# Altium project eRTM15_Baikal.PrjPCB (part 1 of 4)
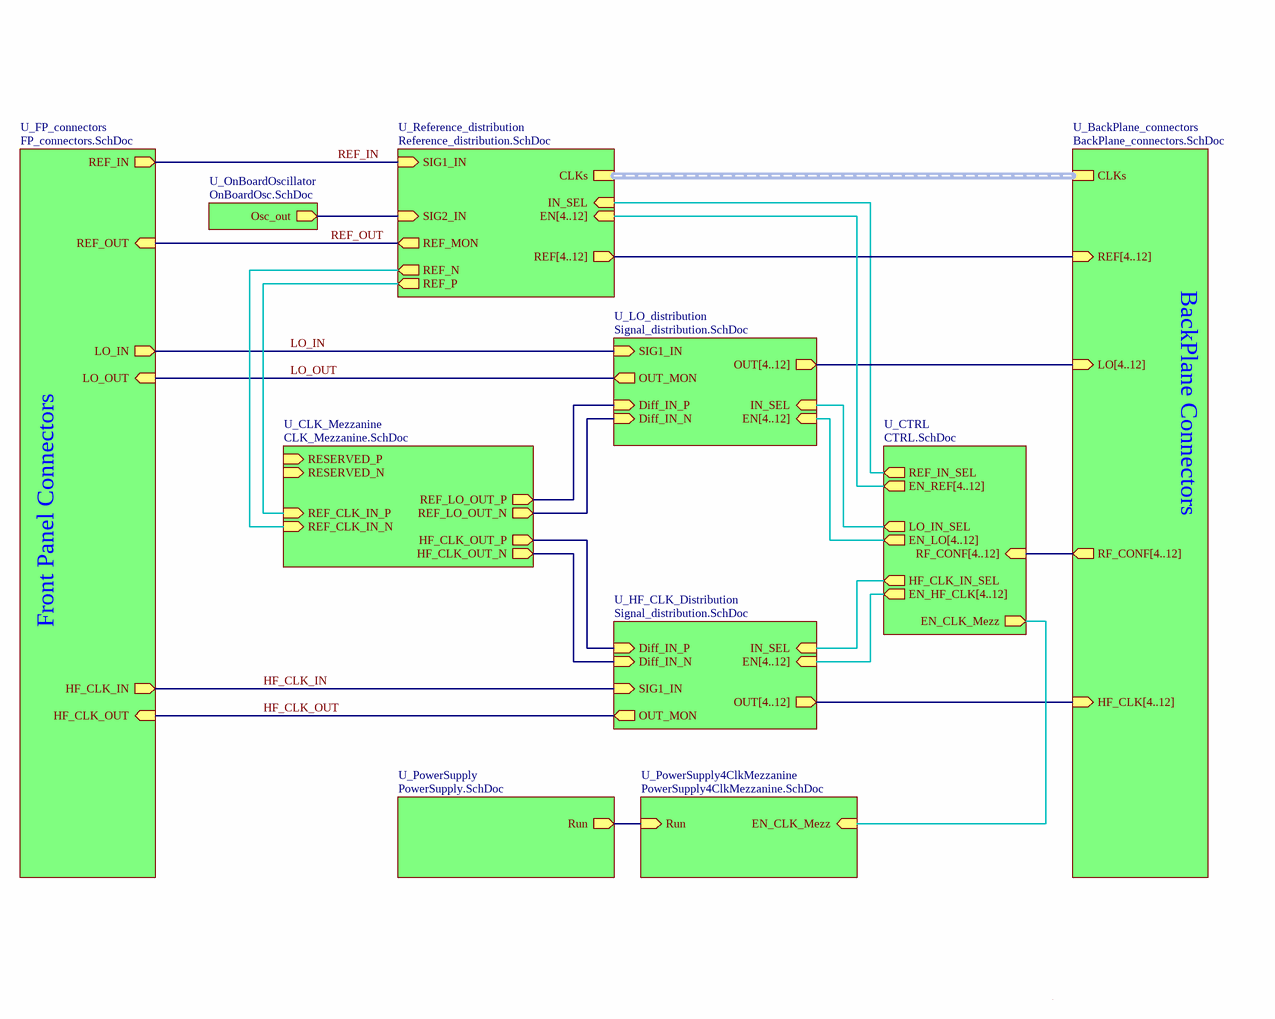
[diagram p0: Baikal_top.SchDoc]
ProjectName: eRTM15 Baikal
12 sheets, 749 parts. Net scope: hierarchical (ports join the sheet entries above them; power ports are global).
Board file: eRTM15_Baikal.PcbDoc
Sheets:
  Baikal_top.SchDoc
    U_FP_connectors = FP_connectors.SchDoc
    U_PowerSupply = PowerSupply.SchDoc
    U_BackPlane_connectors = BackPlane_connectors.SchDoc
    U_CLK_Mezzanine = CLK_Mezzanine.SchDoc
    U_Reference_distribution = Reference_distribution.SchDoc
      U_Diff2SE = Diff2SE.SchDoc
      U_Diff2SE = Diff2SE.SchDoc
      U_Diff2SE = Diff2SE.SchDoc
      U_Diff2SE = Diff2SE.SchDoc
      U_Diff2SE = Diff2SE.SchDoc
      U_Diff2SE = Diff2SE.SchDoc
      U_Diff2SE = Diff2SE.SchDoc
      U_Diff2SE = Diff2SE.SchDoc
      U_Diff2SE = Diff2SE.SchDoc
      U_Diff2SE = Diff2SE.SchDoc
      U_Diff2SE = Diff2SE.SchDoc
      U_Diff2SE = Diff2SE.SchDoc
      U_LvpeclTermWithCtrl = LvpeclTermWithCtrl.SchDoc
      U_LvpeclTermWithCtrl = LvpeclTermWithCtrl.SchDoc
      U_LvpeclTermWithCtrl = LvpeclTermWithCtrl.SchDoc
      U_LvpeclTermWithCtrl = LvpeclTermWithCtrl.SchDoc
      U_LvpeclTermWithCtrl = LvpeclTermWithCtrl.SchDoc
      U_LvpeclTermWithCtrl = LvpeclTermWithCtrl.SchDoc
      U_LvpeclTermWithCtrl = LvpeclTermWithCtrl.SchDoc
      U_LvpeclTermWithCtrl = LvpeclTermWithCtrl.SchDoc
      U_LvpeclTermWithCtrl = LvpeclTermWithCtrl.SchDoc
      U_LvpeclTermWithCtrl = LvpeclTermWithCtrl.SchDoc
      U_Diff2SE = Diff2SE.SchDoc
      U_LvpeclTermWithCtrl = LvpeclTermWithCtrl.SchDoc
      U_LvpeclTermWithCtrl = LvpeclTermWithCtrl.SchDoc
      U_LvpeclTermWithCtrl = LvpeclTermWithCtrl.SchDoc
      U_LvpeclTermWithCtrl = LvpeclTermWithCtrl.SchDoc
      U_LvpeclTermWithCtrl = LvpeclTermWithCtrl.SchDoc
      U_LvpeclTermWithCtrl = LvpeclTermWithCtrl.SchDoc
      U_LvpeclTermWithCtrl = LvpeclTermWithCtrl.SchDoc
      U_LvpeclTermWithCtrl = LvpeclTermWithCtrl.SchDoc
      U_LvpeclTermWithCtrl = LvpeclTermWithCtrl.SchDoc
      U_LvpeclTermWithCtrl = LvpeclTermWithCtrl.SchDoc
      U_LvpeclTermWithCtrl = LvpeclTermWithCtrl.SchDoc
      U_LvpeclTermWithCtrl = LvpeclTermWithCtrl.SchDoc
      U_LvpeclTermWithCtrl = LvpeclTermWithCtrl.SchDoc
    U_OnBoardOscillator = OnBoardOsc.SchDoc
    U_LO_distribution = Signal_distribution.SchDoc
      U_Diff2SE = Diff2SE.SchDoc
      U_Diff2SE = Diff2SE.SchDoc
      U_Diff2SE = Diff2SE.SchDoc
      U_Diff2SE = Diff2SE.SchDoc
      U_Diff2SE = Diff2SE.SchDoc
      U_Diff2SE = Diff2SE.SchDoc
      U_Diff2SE = Diff2SE.SchDoc
      U_Diff2SE = Diff2SE.SchDoc
      U_Diff2SE = Diff2SE.SchDoc
      U_Diff2SE = Diff2SE.SchDoc
      U_LvpeclTermWithCtrl = LvpeclTermWithCtrl.SchDoc
      U_LvpeclTermWithCtrl = LvpeclTermWithCtrl.SchDoc
      U_LvpeclTermWithCtrl = LvpeclTermWithCtrl.SchDoc
      U_LvpeclTermWithCtrl = LvpeclTermWithCtrl.SchDoc
      U_LvpeclTermWithCtrl = LvpeclTermWithCtrl.SchDoc
      U_LvpeclTermWithCtrl = LvpeclTermWithCtrl.SchDoc
      U_LvpeclTermWithCtrl = LvpeclTermWithCtrl.SchDoc
      U_LvpeclTermWithCtrl = LvpeclTermWithCtrl.SchDoc
      U_LvpeclTermWithCtrl = LvpeclTermWithCtrl.SchDoc
      U_Diff2SE = Diff2SE.SchDoc
      U_LvpeclTermWithCtrl = LvpeclTermWithCtrl.SchDoc
    U_HF_CLK_Distribution = Signal_distribution.SchDoc
      U_Diff2SE = Diff2SE.SchDoc
      U_Diff2SE = Diff2SE.SchDoc
      U_Diff2SE = Diff2SE.SchDoc
      U_Diff2SE = Diff2SE.SchDoc
      U_Diff2SE = Diff2SE.SchDoc
      U_Diff2SE = Diff2SE.SchDoc
      U_Diff2SE = Diff2SE.SchDoc
      U_Diff2SE = Diff2SE.SchDoc
      U_Diff2SE = Diff2SE.SchDoc
      U_Diff2SE = Diff2SE.SchDoc
      U_LvpeclTermWithCtrl = LvpeclTermWithCtrl.SchDoc
      U_LvpeclTermWithCtrl = LvpeclTermWithCtrl.SchDoc
      U_LvpeclTermWithCtrl = LvpeclTermWithCtrl.SchDoc
      U_LvpeclTermWithCtrl = LvpeclTermWithCtrl.SchDoc
      U_LvpeclTermWithCtrl = LvpeclTermWithCtrl.SchDoc
      U_LvpeclTermWithCtrl = LvpeclTermWithCtrl.SchDoc
      U_LvpeclTermWithCtrl = LvpeclTermWithCtrl.SchDoc
      U_LvpeclTermWithCtrl = LvpeclTermWithCtrl.SchDoc
      U_LvpeclTermWithCtrl = LvpeclTermWithCtrl.SchDoc
      U_Diff2SE = Diff2SE.SchDoc
      U_LvpeclTermWithCtrl = LvpeclTermWithCtrl.SchDoc
    U_CTRL = CTRL.SchDoc
    U_PowerSupply4ClkMezzanine = PowerSupply4ClkMezzanine.SchDoc

## Sheet Baikal_top.SchDoc: =ProjectName
size 420 x 297 mm; Author: SBH; CompanyName: WUT; DrawnBy: SBH; Organization: ISE-WUT; Address1: Warsaw Univeristy of Technology; Address2: Nowowiejska 15/19; DocumentNumber: 1; Revision: -; SheetNumber: 1; SheetTotal: 12; EDA_Number: ARTIQ; Projet: eRTM15 Baikal; ModifiedBy: -; CreateDate: XX/XX/XXXX; CheckedDate: -; Title2: Baikal_top.SchDoc; DivGrp: ISE; Designer: SBH; ModifiedDate: -; ProjectName: eRTM15 Baikal

### Sub-sheets
U_BackPlane_connectors = BackPlane_connectors.SchDoc: LO[4..12] (in), HF_CLK[4..12] (in), RF_CONF[4..12] (out), CLKs (harness CLKs), REF[4..12] (in)
U_CLK_Mezzanine = CLK_Mezzanine.SchDoc: RESERVED_P (in), RESERVED_N (in), REF_CLK_IN_P (in), REF_CLK_IN_N (in), HF_CLK_OUT_P (out), HF_CLK_OUT_N (out), REF_LO_OUT_P (out), REF_LO_OUT_N (out)
U_CTRL = CTRL.SchDoc: EN_HF_CLK[4..12] (out), EN_LO[4..12] (out), EN_REF[4..12] (out), RF_CONF[4..12] (in), REF_IN_SEL (out), LO_IN_SEL (out), HF_CLK_IN_SEL (out), EN_CLK_Mezz (out)
U_FP_connectors = FP_connectors.SchDoc: LO_OUT (in), HF_CLK_IN (out), HF_CLK_OUT (in), REF_IN (out), REF_OUT (in), LO_IN (out)
U_HF_CLK_Distribution = Signal_distribution.SchDoc: SIG1_IN (in), IN_SEL (in), OUT[4..12] (out), OUT_MON (out), Diff_IN_N (in), Diff_IN_P (in), EN[4..12] (in)
U_LO_distribution = Signal_distribution.SchDoc: SIG1_IN (in), IN_SEL (in), OUT[4..12] (out), OUT_MON (out), Diff_IN_N (in), Diff_IN_P (in), EN[4..12] (in)
U_OnBoardOscillator = OnBoardOsc.SchDoc: Osc_out (out)
U_PowerSupply = PowerSupply.SchDoc: Run (out)
U_PowerSupply4ClkMezzanine = PowerSupply4ClkMezzanine.SchDoc: EN_CLK_Mezz (in), Run (in)
U_Reference_distribution = Reference_distribution.SchDoc: SIG1_IN (in), SIG2_IN (in), IN_SEL (in), CLKs (harness CLKs), REF[4..12] (out), REF_MON (out), EN[4..12] (in), REF_P (out), REF_N (out)

### Nets
EN_CLK_Mezz: sheet U_CTRL/EN_CLK_Mezz, sheet U_PowerSupply4ClkMezzanine/EN_CLK_Mezz
HF_CLK_IN: sheet U_FP_connectors/HF_CLK_IN, sheet U_HF_CLK_Distribution/SIG1_IN
HF_CLK_OUT: sheet U_FP_connectors/HF_CLK_OUT, sheet U_HF_CLK_Distribution/OUT_MON
HF_CLK_OUT_N: sheet U_CLK_Mezzanine/HF_CLK_OUT_N, sheet U_HF_CLK_Distribution/Diff_IN_N
HF_CLK_OUT_P: sheet U_CLK_Mezzanine/HF_CLK_OUT_P, sheet U_HF_CLK_Distribution/Diff_IN_P
IN_SEL: sheet U_Reference_distribution/IN_SEL, sheet U_CTRL/REF_IN_SEL
IN_SEL: sheet U_LO_distribution/IN_SEL, sheet U_CTRL/LO_IN_SEL  [a separate net that carries the same name]
IN_SEL: sheet U_HF_CLK_Distribution/IN_SEL, sheet U_CTRL/HF_CLK_IN_SEL  [a separate net that carries the same name]
LO_IN: sheet U_FP_connectors/LO_IN, sheet U_LO_distribution/SIG1_IN
LO_OUT: sheet U_FP_connectors/LO_OUT, sheet U_LO_distribution/OUT_MON
Osc_out: sheet U_Reference_distribution/SIG2_IN, sheet U_OnBoardOscillator/Osc_out
REF_CLK_IN_N: sheet U_CLK_Mezzanine/REF_CLK_IN_N, sheet U_Reference_distribution/REF_N
REF_CLK_IN_P: sheet U_CLK_Mezzanine/REF_CLK_IN_P, sheet U_Reference_distribution/REF_P
REF_IN: sheet U_FP_connectors/REF_IN, sheet U_Reference_distribution/SIG1_IN
REF_LO_OUT_N: sheet U_CLK_Mezzanine/REF_LO_OUT_N, sheet U_LO_distribution/Diff_IN_N
REF_LO_OUT_P: sheet U_CLK_Mezzanine/REF_LO_OUT_P, sheet U_LO_distribution/Diff_IN_P
REF_OUT: sheet U_FP_connectors/REF_OUT, sheet U_Reference_distribution/REF_MON
RUN: sheet U_PowerSupply/Run, sheet U_PowerSupply4ClkMezzanine/Run

### Buses and harness runs
bus sheet U_BackPlane_connectors/HF_CLK[4..12] = sheet U_HF_CLK_Distribution/OUT[4..12]
bus sheet U_BackPlane_connectors/LO[4..12] = sheet U_LO_distribution/OUT[4..12]
bus sheet U_BackPlane_connectors/REF[4..12] = sheet U_Reference_distribution/REF[4..12]
bus sheet U_BackPlane_connectors/RF_CONF[4..12] = sheet U_CTRL/RF_CONF[4..12]
bus sheet U_CTRL/EN_HF_CLK[4..12] = sheet U_HF_CLK_Distribution/EN[4..12]
bus sheet U_CTRL/EN_LO[4..12] = sheet U_LO_distribution/EN[4..12]
bus sheet U_CTRL/EN_REF[4..12] = sheet U_Reference_distribution/EN[4..12]
harness sheet U_BackPlane_connectors/CLKs = sheet U_Reference_distribution/CLKs

### Notes on the sheet
- BackPlane Connectors
- Front Panel Connectors
- Project/Equipment
- Document
- Designer
- Drawn by
- Check.by
- File
- Last Mod.
- Print Date
- Sheet
- Size
- A3
- of
- Rev

## Sheet FP_connectors.SchDoc: =ProjectName
size 420 x 297 mm; Author: SBH; CompanyName: WUT; DrawnBy: SBH; Organization: ISE-WUT; Address1: Warsaw Univeristy of Technology; Address2: Nowowiejska 15/19; DocumentNumber: 2; Revision: -; SheetNumber: 2; SheetTotal: 12; EDA_Number: ARTIQ; Projet: eRTM15 Baikal; ModifiedBy: -; CreateDate: XX/XX/XXXX; CheckedDate: -; Title2: FP_connectors.SchDoc; DivGrp: ISE; Designer: SBH; ModifiedDate: -; ProjectName: eRTM15 Baikal
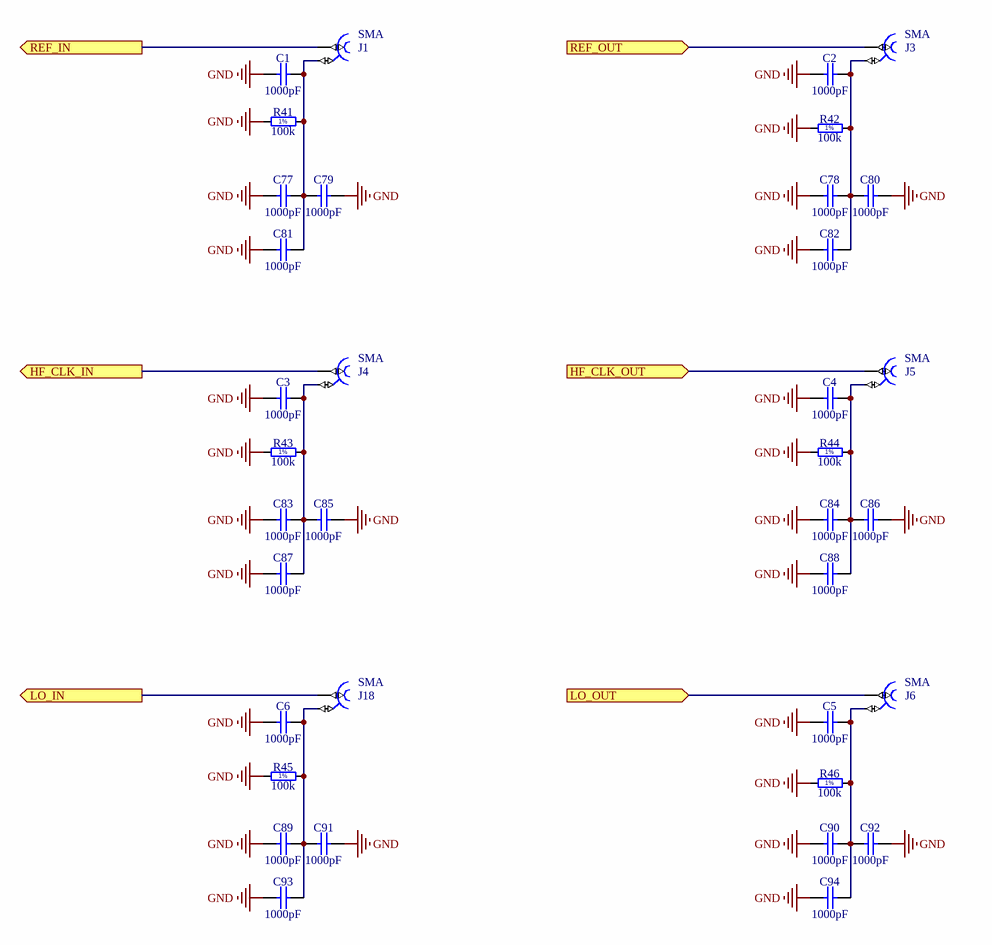
[diagram p1: FP_connectors.SchDoc]

### Parts
C1  1000pF  [CAPC1005X55N]
C2  1000pF  [CAPC1005X55N]
C3  1000pF  [CAPC1005X55N]
C4  1000pF  [CAPC1005X55N]
C5  1000pF  [CAPC1005X55N]
C6  1000pF  [CAPC1005X55N]
C77  1000pF  [CAPC1005X55N]
C78  1000pF  [CAPC1005X55N]
C79  1000pF  [CAPC1005X55N]
C80  1000pF  [CAPC1005X55N]
C81  1000pF  [CAPC1005X55N]
C82  1000pF  [CAPC1005X55N]
C83  1000pF  [CAPC1005X55N]
C84  1000pF  [CAPC1005X55N]
C85  1000pF  [CAPC1005X55N]
C86  1000pF  [CAPC1005X55N]
C87  1000pF  [CAPC1005X55N]
C88  1000pF  [CAPC1005X55N]
C89  1000pF  [CAPC1005X55N]
C90  1000pF  [CAPC1005X55N]
C91  1000pF  [CAPC1005X55N]
C92  1000pF  [CAPC1005X55N]
C93  1000pF  [CAPC1005X55N]
C94  1000pF  [CAPC1005X55N]
J1  SMA  [TELEGARTNER_J01151A0451]
J3  SMA  [TELEGARTNER_J01151A0451]
J4  SMA  [TELEGARTNER_J01151A0451]
J5  SMA  [TELEGARTNER_J01151A0451]
J6  SMA  [TELEGARTNER_J01151A0451]
J18  SMA  [TELEGARTNER_J01151A0451]
R41  100k  [RESC1005X40N]
R42  100k  [RESC1005X40N]
R43  100k  [RESC1005X40N]
R44  100k  [RESC1005X40N]
R45  100k  [RESC1005X40N]
R46  100k  [RESC1005X40N]

### Ports
HF_CLK_IN (out), HF_CLK_OUT (in), LO_IN (out), LO_OUT (in), REF_IN (out), REF_OUT (in)

### Nets
GND: C1.1 C2.1 C3.1 C4.1 C5.1 C6.1 C77.1 C78.1 C79.2 C80.2 C81.1 C82.1 C83.1 C84.1 C85.2 C86.2 C87.1 C88.1 C89.1 C90.1 C91.2 C92.2 C93.1 C94.1 R41.1 R42.1 R43.1 R44.1 R45.1 R46.1
HF_CLK_IN: J4.1 ; port HF_CLK_IN
HF_CLK_OUT: J5.1 ; port HF_CLK_OUT
LO_IN: J18.1 ; port LO_IN
LO_OUT: J6.1 ; port LO_OUT
REF_IN: J1.1 ; port REF_IN
REF_OUT: J3.1 ; port REF_OUT
NetC1_2: C1.2 C77.2 C79.1 C81.2 J1.2 R41.2
NetC2_2: C2.2 C78.2 C80.1 C82.2 J3.2 R42.2
NetC3_2: C3.2 C83.2 C85.1 C87.2 J4.2 R43.2
NetC4_2: C4.2 C84.2 C86.1 C88.2 J5.2 R44.2
NetC5_2: C5.2 C90.2 C92.1 C94.2 J6.2 R46.2
NetC6_2: C6.2 C89.2 C91.1 C93.2 J18.2 R45.2

### Notes on the sheet
- Project/Equipment
- Document
- Designer
- Drawn by
- Check.by
- File
- Last Mod.
- Print Date
- Sheet
- Size
- A3
- of
- Rev
- (in symbol R0402_4K7_1%_0.0625W_100PPM) 1%

### Library data of the parts
C1-C6 C77-C94 = CC0402_100PF_50V_5%_C0G: Non-polarised capacitor; Part Number: CC0402_1000PF_50V_5%_C0G; Part Description: SMD Multilayer Chip Ceramic Capacitor; Manufacturer: GENERIC; Manufacturer1 Part Number: C0402C102J5RACTU; Voltage: 50V; TC: C0G/NP0; Tolerance: ±5%; Component Kind: Standard; Component Type: Standard; Pin Count: 2; Value: 1000pF; Status: Preferred; Manufacturer Part Number: CC0402_100PF_50V_5%_C0G; Case: 0402; Mounted: Yes; Socket: No; SMD: Yes; Sense: No; Manufacturer1 Example: KEMET; Manufacturer1 ComponentHeight: 0.55mm; HelpURL: \\cern.ch\dfs\Applications\Altium\Datasheets\CC0805_C0G_KEMET_(Commercial Grade).pdf; Author: CERN DEM JLC; CreateDate: 2007-12-03; LatestRevisionDate: 2015-04-22
J1 J3-J6 J18 = TELEGARTNER_J01151A0451: Part Description: SMA 50 ohms Edge Mount Bulkhead Jack Receptacle; PressFit: No; Part Number: TELEGARTNER_J01151A0451; Component Kind: Standard; Component Type: Standard; Pin Count: 2; Family: SMA; Mounted: Yes; Socket: No; SMD: No; Sense: No; Status: None; Manufacturer: TELEGARTNER; Manufacturer Part Number: J01151A0451; ComponentHeight: 7mm; HelpURL: \\cern.ch\dfs\Applications\Altium\Datasheets\TELEGARTNER_J01151A0451.pdf; Author: CERN DEM JLC; CreateDate: 27.10.2016; LatestRevisionDate: 27.10.2016
R41-R46 = R0402_4K7_1%_0.0625W_100PPM: Resistor - 1%; Part Number: R0402_100k_1%_0.0625W_100PPM; Part Description: General Purpose Thick Film Chip Resistor; Manufacturer: GENERIC; Manufacturer1 Part Number: RC0402FR-07100KL; TC: ±100ppm/°C; Component Kind: Standard; Component Type: Standard; Pin Count: 2; Value: 100k; Status: Not recommended; Power: 0.0625W; Tolerance: ±1%; Manufacturer Part Number: R0402_4K7_1%_0.0625W_100PPM; Case: 0402; Mounted: Yes; Sense: No; Socket: No; SMD: Yes; Manufacturer1 Example: YAGEO PHYCOMP; Manufacturer1 ComponentHeight: 0.4mm; HelpURL: \\cern.ch\dfs\Applications\Altium\Datasheets\R0402_Phycomp_RC0402.pdf; Author: CERN DEM JLC; CreateDate: 2007-12-03; LatestRevisionDate: 2012-10-17

## Sheet PowerSupply.SchDoc: =ProjectName
size 420 x 297 mm; Author: SBH; CompanyName: WUT; DrawnBy: SBH; Organization: ISE-WUT; Address1: Warsaw Univeristy of Technology; Address2: Nowowiejska 15/19; DocumentNumber: 3; Revision: -; SheetNumber: 3; SheetTotal: 12; EDA_Number: ARTIQ; Projet: eRTM15 Baikal; ModifiedBy: -; CreateDate: XX/XX/XXXX; CheckedDate: -; Title2: PowerSupply.SchDoc; DivGrp: ISE; Designer: SBH; ModifiedDate: -; ProjectName: eRTM15 Baikal
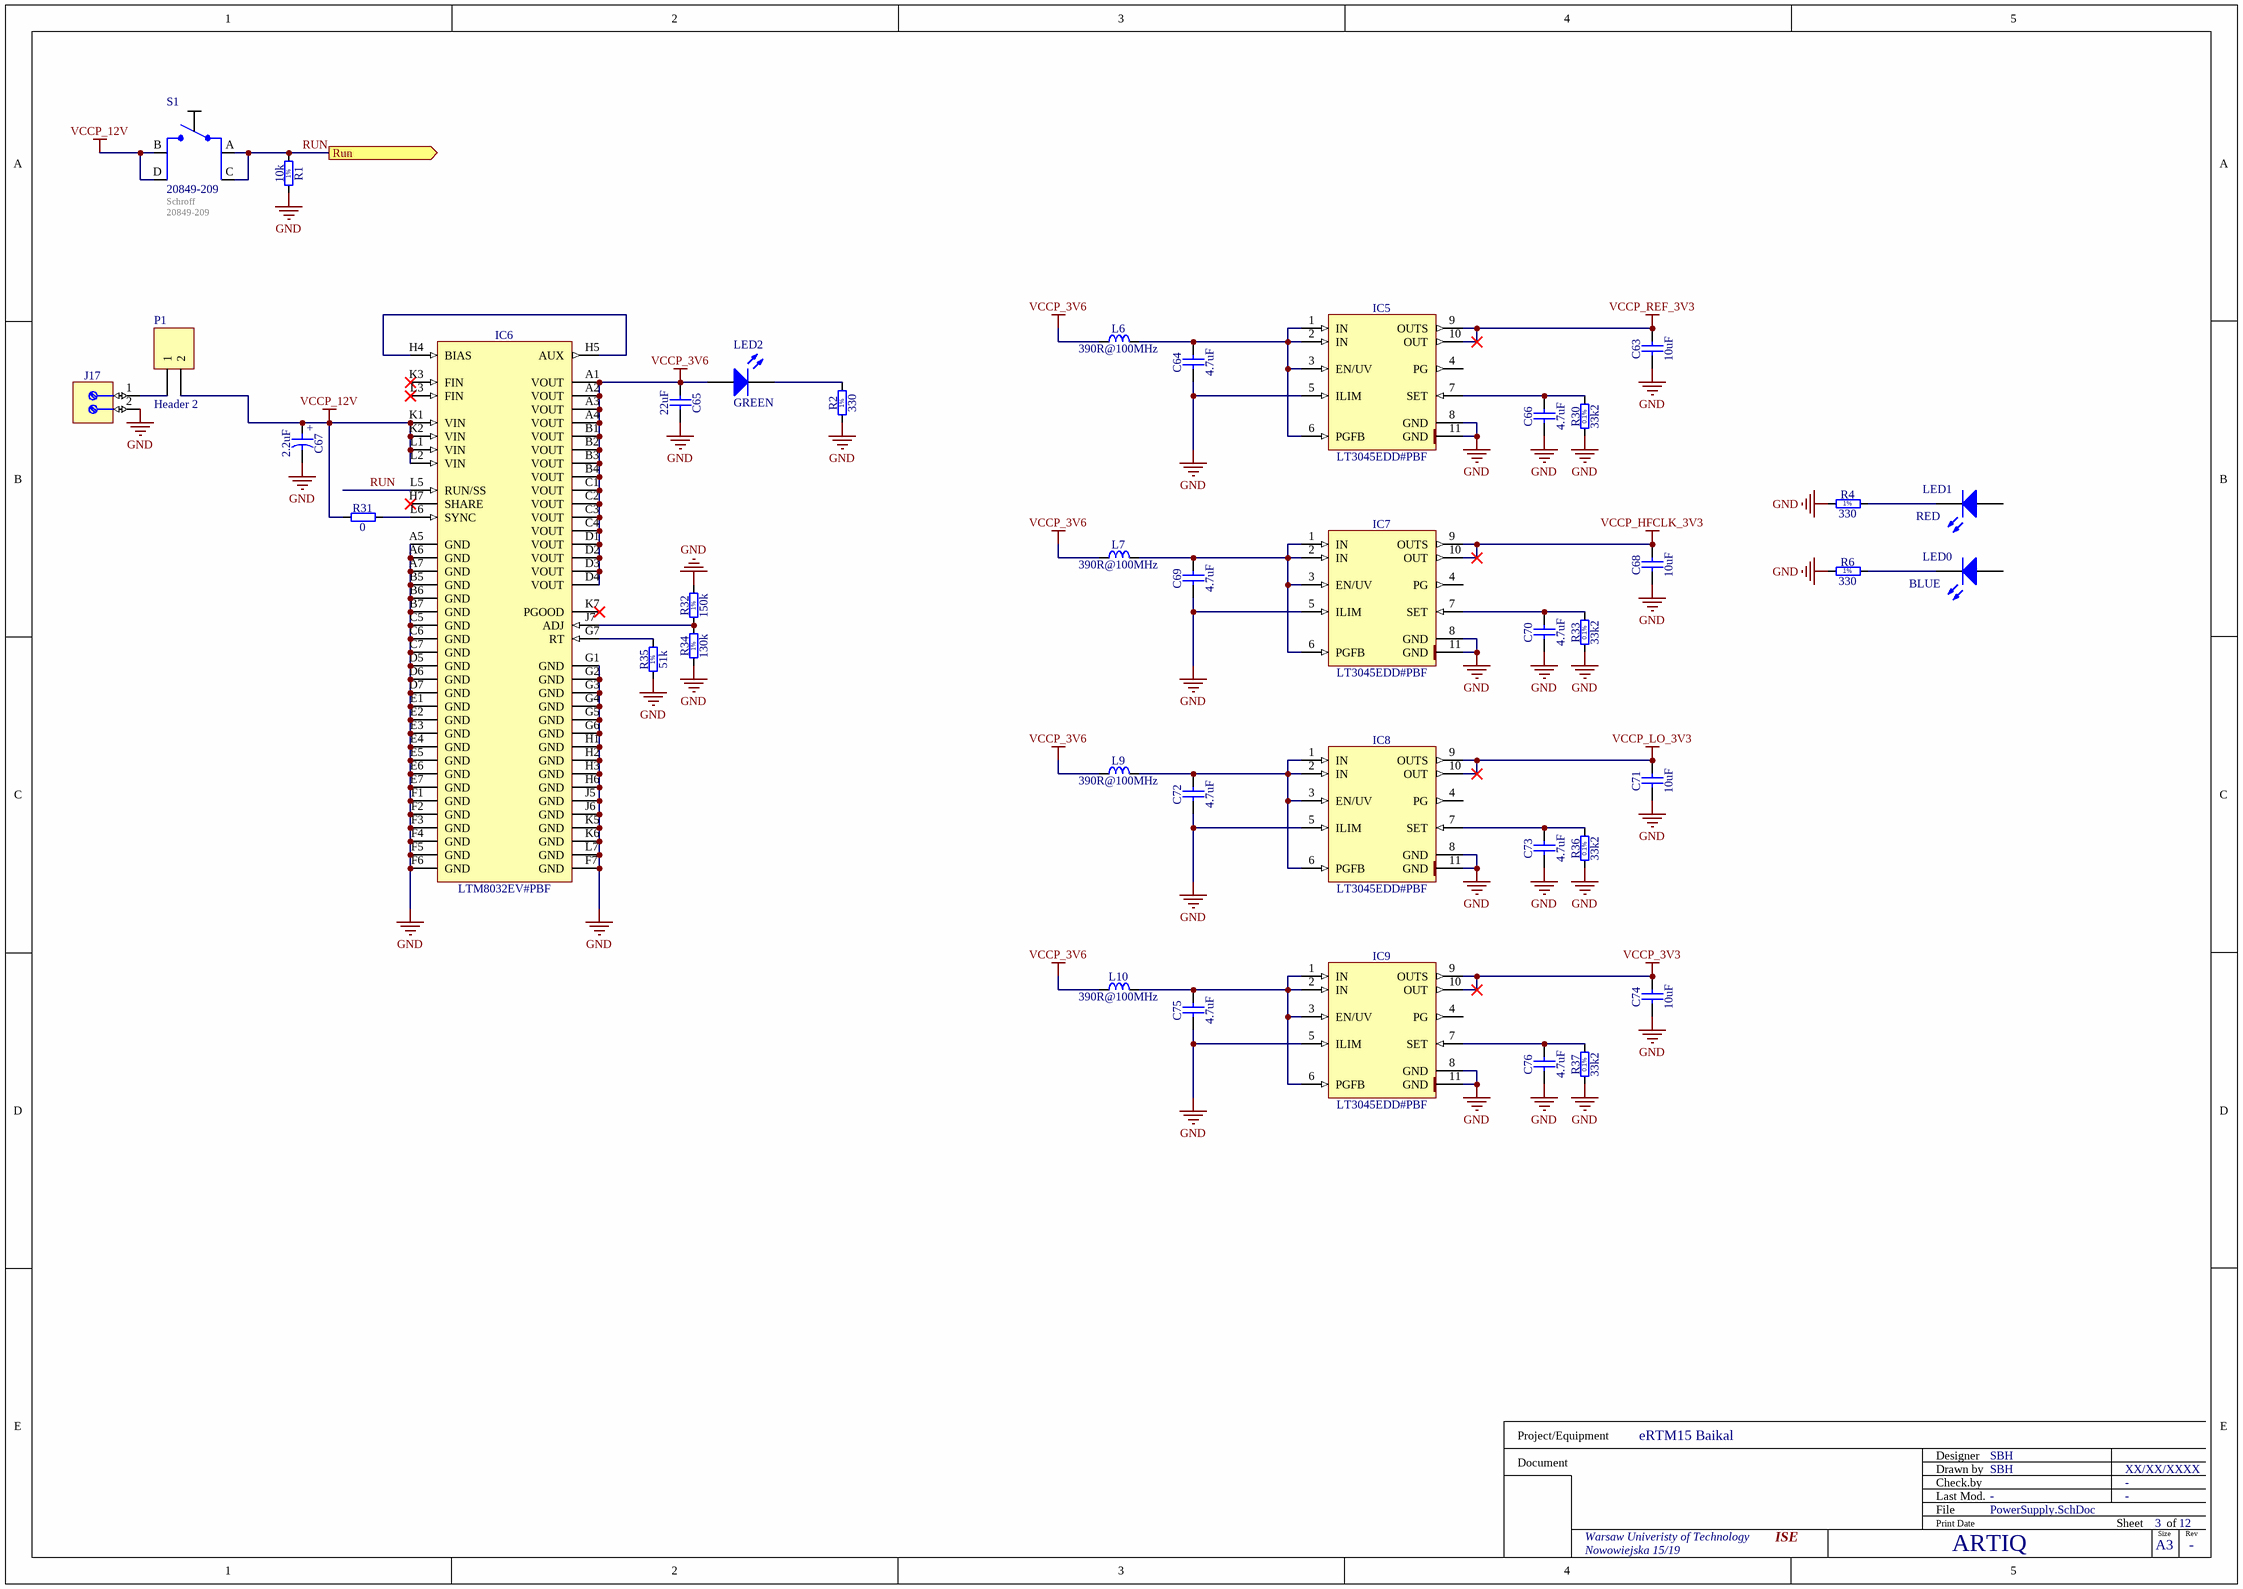
[diagram p2: PowerSupply.SchDoc]

### Parts
C63  10uF  [CAPC1608X87N]
C64  4.7uF  [CAPC1709X95N]
C65  22uF  [CAPC3216X180N]
C66  4.7uF  [CAPC1709X95N]
C67  2.2uF  [CAPMP3216X180N]
C68  10uF  [CAPC1608X87N]
C69  4.7uF  [CAPC1709X95N]
C70  4.7uF  [CAPC1709X95N]
C71  10uF  [CAPC1608X87N]
C72  4.7uF  [CAPC1709X95N]
C73  4.7uF  [CAPC1709X95N]
C74  10uF  [CAPC1608X87N]
C75  4.7uF  [CAPC1709X95N]
C76  4.7uF  [CAPC1709X95N]
IC5  LT3045EDD#PBF  [SON50P300X300X80-11N-R175X248]
IC6  LTM8032EV#PBF  [LGA71S127P7X11_900X1500X297]
IC7  LT3045EDD#PBF  [SON50P300X300X80-11N-R175X248]
IC8  LT3045EDD#PBF  [SON50P300X300X80-11N-R175X248]
IC9  LT3045EDD#PBF  [SON50P300X300X80-11N-R175X248]
J17  Terminal  [WIELAND_25.161.0253.0]  (value not drawn)
L6  390R@100MHz  [INDC1608X95N]
L7  390R@100MHz  [INDC1608X95N]
L9  390R@100MHz  [INDC1608X95N]
L10  390R@100MHz  [INDC1608X95N]
LED0  BLUE  [0603LED]
LED1  RED  [0603LED]
LED2  GREEN  [0603LED]
P1  Header 2  [HDR1X2]
R1  10k  [RESC1005X40N]
R2  330  [RESC1005X40N]
R4  330  [RESC1005X40N]
R6  330  [RESC1005X40N]
R30  33k2  [RESC1608X55N]
R31  0  [RESC1005X40N]
R32  150k  [RESC1005X40N]
R33  33k2  [RESC1608X55N]
R34  130k  [RESC1005X40N]
R35  51k  [RESC1005X40N]
R36  33k2  [RESC1608X55N]
R37  33k2  [RESC1608X55N]
S1  20849-209  Distributor: Schroff  [4-pin Switch]

### Ports
Run (out)

### Nets
GND: C63.1 C64.1 C65.2 C66.1 C67.2 C68.1 C69.1 C70.1 C71.1 C72.1 C73.1 C74.1 C75.1 C76.1 IC5.5(ILIM) IC5.8(GND) IC5.11(GND) IC6.A5(GND) IC6.A6(GND) IC6.A7(GND) IC6.B5(GND) IC6.B6(GND) IC6.B7(GND) IC6.C5(GND) IC6.C6(GND) IC6.C7(GND) IC6.D5(GND) IC6.D6(GND) IC6.D7(GND) IC6.E1(GND) IC6.E2(GND) IC6.E3(GND) IC6.E4(GND) IC6.E5(GND) IC6.E6(GND) IC6.E7(GND) IC6.F1(GND) IC6.F2(GND) IC6.F3(GND) IC6.F4(GND) IC6.F5(GND) IC6.F6(GND) IC6.F7(GND) IC6.G1(GND) IC6.G2(GND) IC6.G3(GND) IC6.G4(GND) IC6.G5(GND) IC6.G6(GND) IC6.H1(GND) IC6.H2(GND) IC6.H3(GND) IC6.H6(GND) IC6.J5(GND) IC6.J6(GND) IC6.K5(GND) IC6.K6(GND) IC6.L7(GND) IC7.5(ILIM) IC7.8(GND) IC7.11(GND) IC8.5(ILIM) IC8.8(GND) IC8.11(GND) IC9.5(ILIM) IC9.8(GND) IC9.11(GND) J17.2 R1.1 R2.1 R4.1 R6.1 R30.1 R32.2 R33.1 R34.1 R35.1 R36.1 R37.1
VCCP_3V3: C74.2 IC9.9(OUTS) IC9.10(OUT)
VCCP_3V6: C65.1 IC6.A1(VOUT) IC6.A2(VOUT) IC6.A3(VOUT) IC6.A4(VOUT) IC6.B1(VOUT) IC6.B2(VOUT) IC6.B3(VOUT) IC6.B4(VOUT) IC6.C1(VOUT) IC6.C2(VOUT) IC6.C3(VOUT) IC6.C4(VOUT) IC6.D1(VOUT) IC6.D2(VOUT) IC6.D3(VOUT) IC6.D4(VOUT) L6.1 L7.1 L9.1 L10.1 LED2.1(A)
VCCP_12V: C67.1 IC6.K1(VIN) IC6.K2(VIN) IC6.L1(VIN) IC6.L2(VIN) P1.2 R31.1 S1.B S1.D
VCCP_HFCLK_3V3: C68.2 IC7.9(OUTS) IC7.10(OUT)
VCCP_LO_3V3: C71.2 IC8.9(OUTS) IC8.10(OUT)
VCCP_REF_3V3: C63.2 IC5.9(OUTS) IC5.10(OUT)
RUN: IC6.L5(RUN/SS) R1.2 S1.A S1.C ; port Run
NetC64_2: C64.2 IC5.1(IN) IC5.2(IN) IC5.3(EN/UV) IC5.6(PGFB) L6.2
NetC66_2: C66.2 IC5.7(SET) R30.2
NetC69_2: C69.2 IC7.1(IN) IC7.2(IN) IC7.3(EN/UV) IC7.6(PGFB) L7.2
NetC70_2: C70.2 IC7.7(SET) R33.2
NetC72_2: C72.2 IC8.1(IN) IC8.2(IN) IC8.3(EN/UV) IC8.6(PGFB) L9.2
NetC73_2: C73.2 IC8.7(SET) R36.2
NetC75_2: C75.2 IC9.1(IN) IC9.2(IN) IC9.3(EN/UV) IC9.6(PGFB) L10.2
NetC76_2: C76.2 IC9.7(SET) R37.2
NetIC6_G7: IC6.G7(RT) R35.2
NetIC6_H4: IC6.H4(BIAS) IC6.H5(AUX)
NetIC6_J7: IC6.J7(ADJ) R32.1 R34.2
NetIC6_L6: IC6.L6(SYNC) R31.2
NetJ17_1: J17.1 P1.1
NetLED0_2: LED0.2(K) R6.2
NetLED1_2: LED1.2(K) R4.2
NetLED2_2: LED2.2(K) R2.2

Not connected (* = marked no-connect by the designer): IC5 4(PG); IC6 H7(SHARE)* K3(FIN)* K7(PGOOD)* L3(FIN)*; IC7 4(PG); IC8 4(PG); IC9 4(PG); LED0 1(A); LED1 1(A)

### Notes on the sheet
- Project/Equipment
- Document
- Designer
- Drawn by
- Check.by
- File
- Last Mod.
- Print Date
- Sheet
- Size
- A3
- of
- Rev
- (in symbol CTE3216-18_2.2UF_25V_10%) +
- (in symbol R0402_10K_1%_0.0625W_100PPM) 1%
- (in symbol R0402_51K_1%_0.0625W_100PPM) 1%
- (in symbol R0402_130K_1%_0.0625W_100PPM) 1%
- (in symbol R0402_150K_1%_0.0625W_100PPM) 1%
- (in symbol R0402_330R_1%_0.0625W_100PPM) 1%
- (in symbol R0603_33K2_0.1%_0.063W_10PPM) 0.1%

### Library data of the parts
C63 C68 C71 C74 = CC0603_10UF_6.3V_20%_X5R: Non-polarised capacitor; Part Description: SMD Multilayer Chip Ceramic Capacitor; Manufacturer: GENERIC; Manufacturer1 Part Number: C0603C106M9PAC; Voltage: 6.3V; TC: X5R; Tolerance: ±20%; Part Number: CC0603_10UF_6.3V_20%_X5R; Component Kind: Standard; Component Type: Standard; Pin Count: 2; Value: 10uF; Status: Preferred; Manufacturer Part Number: CC0603_10uF_6.3V_20%_X5R; Case: 0603; Mounted: Yes; Socket: No; SMD: Yes; Sense: No; Manufacturer1 Example: KEMET; Manufacturer1 ComponentHeight: 0.95mm; HelpURL: \\cern.ch\dfs\Applications\Altium\Datasheets\CC0603_X5R_KEMET.pdf; Author: CERN DEM JLC; CreateDate: 2007-12-03; LatestRevisionDate: 2007-12-03
C64 C66 C69 C70 C72 C73 C75 C76 = CC0603_4.7UF_16V_10%_X5R: Non-polarised capacitor; Part Description: SMD Multilayer Chip Ceramic Capacitor; Manufacturer: GENERIC; Manufacturer1 Part Number: EMK107ABJ475KA-T; Voltage: 16V; TC: X5R; Tolerance: ±10%; Part Number: CC0603_4.7UF_16V_10%_X5R; Component Kind: Standard; Component Type: Standard; Pin Count: 2; Value: 4.7uF; Status: None; Manufacturer Part Number: CC0603_4.7UF_16V_10%_X5R; Case: 0603; Mounted: Yes; Socket: No; SMD: Yes; Sense: No; Manufacturer1 Example: TAIYO YUDEN; Manufacturer1 ComponentHeight: 0.95mm; HelpURL: \\cern.ch\dfs\Applications\Altium\Datasheets\CC0603_X7R_TAIYO-YUDEN_HIGH-VALUE.pdf; Author: CERN DEM JLC; CreateDate: 2013-12-16; LatestRevisionDate: 2014-09-16
C65 = CC1206_22UF_10V_10%_X7R: Non-polarised capacitor; Part Description: SMD Multilayer Chip Ceramic Capacitor; Manufacturer: GENERIC; Manufacturer1 Part Number: GRM31CR71A226KE15L; Voltage: 10V; TC: X7R; Tolerance: ±10%; Part Number: CC1206_22UF_10V_10%_X7R; Component Kind: Standard; Component Type: Standard; Pin Count: 2; Value: 22uF; Status: Preferred; Manufacturer Part Number: CC1206_22UF_10V_10%_X7R; Case: 1206; Mounted: Yes; Socket: No; SMD: Yes; Sense: No; Manufacturer1 Example: MURATA; Manufacturer1 ComponentHeight: 1.8mm; HelpURL: \\cern.ch\dfs\Applications\Altium\Datasheets\CC1206_X7R_MURATA_GRM-HI-CAP.pdf; Author: CERN DEM JLC; CreateDate: 2010-06-08; LatestRevisionDate: 2010-06-08
C67 = CTE3216-18_2.2UF_25V_10%: Polarised capacitor; Part Description: Solid Tantalum Chip Capacitor; Manufacturer: GENERIC; Manufacturer1 Part Number: TAJA225K025R; Voltage: 25V; Tolerance: ±10%; Part Number: CTE3216-18_2.2UF_25V_10%; Component Kind: Standard; Component Type: Standard; Pin Count: 2; Value: 2.2uF; Status: Preferred; Manufacturer Part Number: CTE3216-18_2.2UF_25V_10%; Case: A; Mounted: Yes; Socket: No; SMD: Yes; Sense: No; Manufacturer1 Example: AVX; Manufacturer1 ComponentHeight: 1.8mm; HelpURL: \\cern.ch\dfs\Applications\Altium\Datasheets\CTE_AVX_TAJ.pdf; Author: CERN DEM JLC; CreateDate: 2008-05-26; LatestRevisionDate: 2008-05-26
IC5 IC7-IC9 = LT3045EDD#PBF: 20V, 500mA, Ultralow Noise, Ultrahigh PSRR Linear Regulator; Manufacturer: LINEAR TECHNOLOGY; PressFit: No; Bonding: No; Part Number: LT3045EDD#PBF; Component Kind: Standard; Component Type: Standard; Device: LT3045EDD#PBF; PackageDescription: SON, 0.50mm Pitch, 10-pin, 3.00mm W  X 3.00mm L X 0.80mm Height, (w/thermal tab 1.75 X 2.48 mm), IPC Medium Density; Part Description: 20V, 500mA, Ultralow Noise, Ultrahigh PSRR Linear Regulator; Manufacturer Part Number: LT3045EDD#PBF; Pin Count: 11; Case: SON10; Mounted: Yes; Socket: No; SMD: Yes; Sense: No; ComponentHeight: 0.8mm; HelpURL: \\cern.ch\dfs\Applications\Altium\Datasheets\LT3045EDD#PBF.pdf; Author: CERN DEM JLC; CreateDate: 2016-12-07; LatestRevisionDate: 2016-12-07
IC6 = LTM8032EV#PBF: 3V-36V To 0.8V-10V, Iout 2A Ultralow Noise EMC Compliant DC/DC uModule; Part Description: 3V-36V To 0.8V-10V, Iout 2A, Ultralow Noise EMC Compliant DC-DC uModule; Manufacturer: LINEAR TECHNOLOGY; PressFit: No; Bonding: No; Part Number: LTM8032EV#PBF; Component Kind: Standard; Component Type: Standard; Device: LTM8032EV#PBF; PackageDescription: LGA, 1.27mm pitch, rect., 71 pin, 7 columns X 11 rows, 9mm X 15mm X 2.97mm H; Manufacturer Part Number: LTM8032EV#PBF; Pin Count: 71; Case: LGA71; Mounted: Yes; Socket: No; SMD: Yes; Sense: No; ComponentHeight: 2.97mm; HelpURL: \\cern.ch\dfs\Applications\Altium\Datasheets\LTM8032EV#PBF.pdf; Author: CERN DEM JLC; CreateDate: 2009-06-17; LatestRevisionDate: 2011-12-07
J17 = WIELAND_25.161.0253.0: Terminal Block, 2 Positions, Screw Connection; Part Description: 16A 250VAC 2 Way PCB Terminal Block, Pitch 5mm, Screw Connection, Wire Size Max: 2.5mm²; PressFit: No; Part Number: WIELAND_25.161.0253.0; Component Kind: Standard; Component Type: Standard; Pin Count: 3; Family: Terminal; Mounted: Yes; Socket: No; SMD: No; Sense: No; Status: None; Manufacturer: WIELAND; Manufacturer Part Number: 25.161.0253.0; ComponentHeight: 15mm; HelpURL: \\cern.ch\dfs\Applications\Altium\Datasheets\WIELAND_25.161.0253.0.pdf; Author: CERN DEM JLC; CreateDate: 2009-06-03; LatestRevisionDate: 2009-06-03
L6 L7 L9 L10 = IND0603_TDK_MPZ1608R391A: Inductor; Part Description: SMT Chip Bead for Power Line; Manufacturer: TDK; Power: 1.2A; Resistance: 0.12R; Tolerance: ±25%; Part Number: IND0603_TDK_MPZ1608R391A; Component Kind: Standard; Component Type: Standard; Pin Count: 2; Value: 390R@100MHz; Status: None; Manufacturer Part Number: MPZ1608R391A; Case: 0603; Mounted: Yes; Socket: No; SMD: Yes; Sense: No; ComponentHeight: 0.95mm; HelpURL: \\cern.ch\dfs\Applications\Altium\Datasheets\IND0603_TDK_MPZ1608.pdf; Author: CERN DEM JLC; CreateDate: 2009-12-02; LatestRevisionDate: 2009-12-02
LED0 = LED2: LED; Type: SMT; Value: BLUE; Package: 0603
LED1 LED2 = LED3: LED; Type: SMT; Package: 0603
  LED1: Value: RED
  LED2: Value: GREEN
P1 = Header 2: Header, 2-Pin; LatestRevisionDate: 17-Jul-2002; LatestRevisionNote: Re-released for DXP Platform.; Publisher: Altium Limited
R1 = R0402_10K_1%_0.0625W_100PPM: Resistor - 1%; Part Description: General Purpose Thick Film Chip Resistor; Manufacturer: GENERIC; Manufacturer1 Part Number: 232270671003L; TC: ±100ppm/°C; Part Number: R0402_10K_1%_0.0625W_100PPM; Component Kind: Standard; Component Type: Standard; Pin Count: 2; Value: 10k; Status: Not recommended; Power: 0.0625W; Tolerance: ±1%; Manufacturer Part Number: R0402_10K_1%_0.0625W_100PPM; Case: 0402; Mounted: Yes; Sense: No; Socket: No; SMD: Yes; Manufacturer1 Example: YAGEO PHYCOMP; Manufacturer1 ComponentHeight: 0.4mm; HelpURL: \\cern.ch\dfs\Applications\Altium\Datasheets\R0402_Phycomp_RC0402.pdf; Author: CERN DEM JLC; CreateDate: 2007-12-03; LatestRevisionDate: 2012-10-17
R2 R4 R6 = R0402_330R_1%_0.0625W_100PPM: Resistor - 1%; Part Description: General Purpose Thick Film Chip Resistor; Manufacturer: GENERIC; Manufacturer1 Part Number: 232270673301L; TC: ±100ppm/°C; Part Number: R0402_330R_1%_0.0625W_100PPM; Component Kind: Standard; Component Type: Standard; Pin Count: 2; Value: 330; Status: Not recommended; Power: 0.0625W; Tolerance: ±1%; Manufacturer Part Number: R0402_330R_1%_0.0625W_100PPM; Case: 0402; Mounted: Yes; Sense: No; Socket: No; SMD: Yes; Manufacturer1 Example: YAGEO PHYCOMP; Manufacturer1 ComponentHeight: 0.4mm; HelpURL: \\cern.ch\dfs\Applications\Altium\Datasheets\R0402_Phycomp_RC0402.pdf; Author: CERN DEM JLC; CreateDate: 2007-12-03; LatestRevisionDate: 2012-10-17
R30 R33 R36 R37 = R0603_33K2_0.1%_0.063W_10PPM: Resistor - 0.1%; Part Description: Thin Film Chip Resistor; Manufacturer: GENERIC; Manufacturer1 Part Number: RN73C1J33K2BTDF; Power: 0.063W; TC: ±10ppm; Part Number: R0603_33K2_0.1%_0.063W_10PPM; Component Kind: Standard; Component Type: Standard; Pin Count: 2; Value: 33k2; Status: Not recommended; Tolerance: ±0.1%; Manufacturer Part Number: R0603_33K2_0.1%_0.063W_10PPM; Case: 0603; Mounted: Yes; Sense: No; Socket: No; SMD: Yes; Manufacturer1 Example: TYCO HOLSWORTHY; Manufacturer1 ComponentHeight: 0.5mm; HelpURL: \\cern.ch\dfs\Applications\Altium\Datasheets\R0603_Tyco_RN73.pdf; Author: CERN DEM JLC; CreateDate: 2007-12-03; LatestRevisionDate: 2008-03-13
R31 = R0402_0R_JUMPER: Resistor; Part Description: 1A (0.05R Max DC Resistance) Zero Ohm Jumper; Manufacturer: GENERIC; Manufacturer1 Part Number: 232270591001L; Part Number: R0402_0R_JUMPER; Component Kind: Standard; Component Type: Standard; Pin Count: 2; Value: 0; Status: Not recommended; Manufacturer Part Number: R0402_0R_JUMPER; Case: 0402; Mounted: Yes; Sense: No; Socket: No; SMD: Yes; Manufacturer1 Example: YAGEO PHYCOMP; Manufacturer1 ComponentHeight: 0.4mm; HelpURL: \\cern.ch\dfs\Applications\Altium\Datasheets\R0402_Phycomp_RC0402.pdf; Author: CERN DEM JLC; CreateDate: 2007-12-03; LatestRevisionDate: 2012-10-17
R32 = R0402_150K_1%_0.0625W_100PPM: Resistor - 1%; Part Description: General Purpose Thick Film Chip Resistor; Manufacturer: GENERIC; Manufacturer1 Part Number: 232270671504L; TC: ±100ppm/°C; Part Number: R0402_150K_1%_0.0625W_100PPM; Component Kind: Standard; Component Type: Standard; Pin Count: 2; Value: 150k; Status: Not recommended; Power: 0.0625W; Tolerance: ±1%; Manufacturer Part Number: R0402_150K_1%_0.0625W_100PPM; Case: 0402; Mounted: Yes; Sense: No; Socket: No; SMD: Yes; Manufacturer1 Example: YAGEO PHYCOMP; Manufacturer1 ComponentHeight: 0.4mm; HelpURL: \\cern.ch\dfs\Applications\Altium\Datasheets\R0402_Phycomp_RC0402.pdf; Author: CERN DEM JLC; CreateDate: 2007-12-03; LatestRevisionDate: 2012-10-17
R34 = R0402_130K_1%_0.0625W_100PPM: Resistor - 1%; Part Description: General Purpose Thick Film Chip Resistor; Manufacturer: GENERIC; Manufacturer1 Part Number: 232270671304L; TC: ±100ppm/°C; Part Number: R0402_130K_1%_0.0625W_100PPM; Component Kind: Standard; Component Type: Standard; Pin Count: 2; Value: 130k; Status: Not recommended; Power: 0.0625W; Tolerance: ±1%; Manufacturer Part Number: R0402_130K_1%_0.0625W_100PPM; Case: 0402; Mounted: Yes; Sense: No; Socket: No; SMD: Yes; Manufacturer1 Example: YAGEO PHYCOMP; Manufacturer1 ComponentHeight: 0.4mm; HelpURL: \\cern.ch\dfs\Applications\Altium\Datasheets\R0402_Phycomp_RC0402.pdf; Author: CERN DEM JLC; CreateDate: 2007-12-03; LatestRevisionDate: 2012-10-17
R35 = R0402_51K_1%_0.0625W_100PPM: Resistor - 1%; Part Description: General Purpose Thick Film Chip Resistor; Manufacturer: GENERIC; Manufacturer1 Part Number: 232270674703L; TC: ±100ppm/°C; Part Number: R0402_51K_1%_0.0625W_100PPM; Component Kind: Standard; Component Type: Standard; Pin Count: 2; Value: 51k; Status: Not recommended; Power: 0.0625W; Tolerance: ±1%; Manufacturer Part Number: R0402_51K_1%_0.0625W_100PPM; Case: 0402; Mounted: Yes; Sense: No; Socket: No; SMD: Yes; Manufacturer1 Example: YAGEO PHYCOMP; Manufacturer1 ComponentHeight: 0.4mm; HelpURL: \\cern.ch\dfs\Applications\Altium\Datasheets\R0402_Phycomp_RC0402.pdf; Author: CERN DEM JLC; CreateDate: 2007-12-03; LatestRevisionDate: 2012-10-17
S1 = 4-pin Switch: Mikroschalter fuer AMC-Modul (Schliesser); Manufacturer: Schroff; DistributorNr: 20849-209; ManufacturerNr: 20849-209; Type: SMT; Value: 20849-209; Package: 4-pin Switch

## Sheet BackPlane_connectors.SchDoc: =ProjectName
size 420 x 297 mm; Author: SBH; CompanyName: WUT; DrawnBy: SBH; Organization: ISE-WUT; Address1: Warsaw Univeristy of Technology; Address2: Nowowiejska 15/19; DocumentNumber: 4; Revision: -; SheetNumber: 4; SheetTotal: 12; EDA_Number: ARTIQ; Projet: eRTM15 Baikal; ModifiedBy: -; CreateDate: XX/XX/XXXX; CheckedDate: -; Title2: BackPlane_connectors.SchDoc; DivGrp: ISE; Designer: SBH; ModifiedDate: -; ProjectName: eRTM15 Baikal
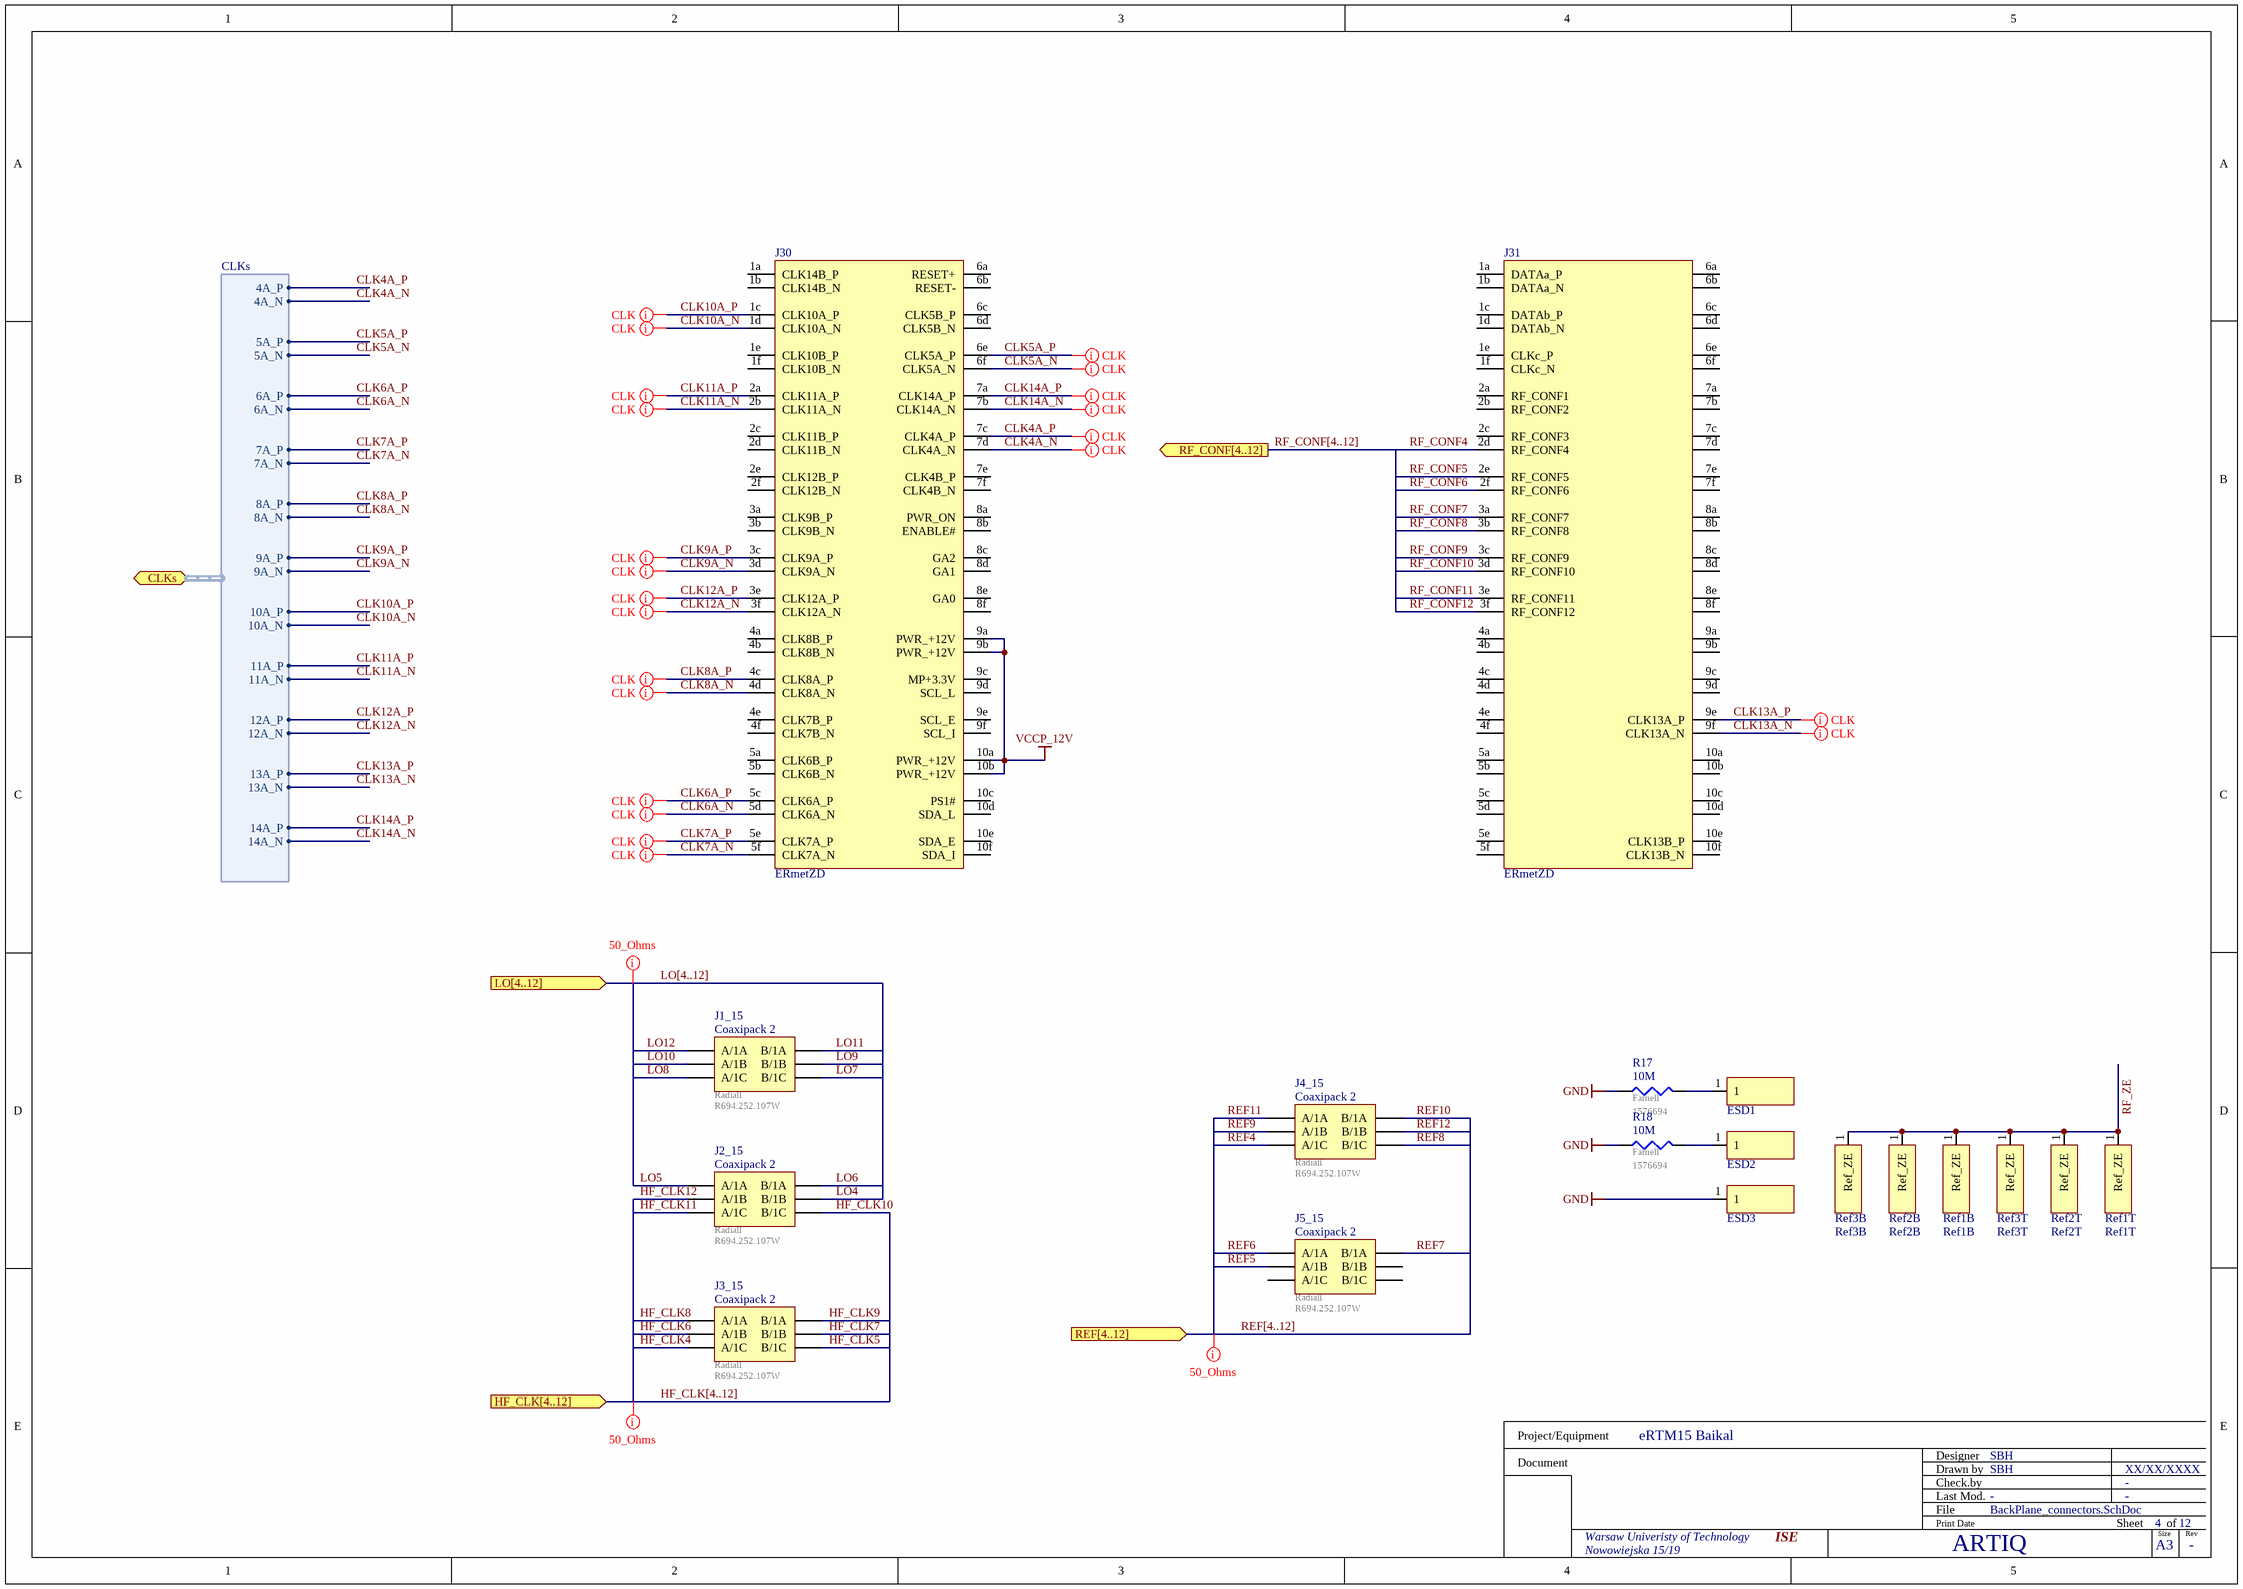
[diagram p3: BackPlane_connectors.SchDoc]

### Parts
ESD1  ESD  [ESD 1&2]  (value not drawn)
ESD2  ESD  [ESD 1&2]  (value not drawn)
ESD3  ESD  [ESD 3]  (value not drawn)
J1_15  value Coaxipack 2  Distributor: Radiall  DistributorNr: R694.252.107W  [Coaxipack2]  (hidden comment: CoaxiPack (Radiall))
J2_15  value Coaxipack 2  Distributor: Radiall  DistributorNr: R694.252.107W  [Coaxipack2]  (hidden comment: CoaxiPack (Radiall))
J3_15  value Coaxipack 2  Distributor: Radiall  DistributorNr: R694.252.107W  [Coaxipack2]  (hidden comment: CoaxiPack (Radiall))
J4_15  value Coaxipack 2  Distributor: Radiall  DistributorNr: R694.252.107W  [Coaxipack2]  (hidden comment: CoaxiPack (Radiall))
J5_15  value Coaxipack 2  Distributor: Radiall  DistributorNr: R694.252.107W  [Coaxipack2]  (hidden comment: CoaxiPack (Radiall))
J30  ERmetZD  [ERmet ZD 3-10 Connector 973028]
J31  ERmetZD  [ERmet ZD 3-10 Connector 973028]
R17  Distributor: Farnell  DistributorNr: 1576694  [1206_ZE]  (hidden comment: 10M)
R18  Distributor: Farnell  DistributorNr: 1576694  [1206_ZE]  (hidden comment: 10M)
Ref1B  Ref1B  [RefPad_1.5mm]
Ref1T  Ref1T  [RefPad_1.5mm]
Ref2B  Ref2B  [RefPad_1.5mm]
Ref2T  Ref2T  [RefPad_1.5mm]
Ref3B  Ref3B  [RefPad_1.5mm]
Ref3T  Ref3T  [RefPad_1.5mm]

### Ports
CLKs (harness CLKs), HF_CLK[4..12] (in), LO[4..12] (in), REF[4..12] (in), RF_CONF[4..12] (out)

### Harnesses
CLKs: 4A_P, 4A_N, 5A_P, 5A_N, 6A_P, 6A_N, 7A_P, 7A_N, 8A_P, 8A_N, 9A_P, 9A_N, 10A_P, 10A_N, 11A_P, 11A_N, 12A_P, 12A_N, 13A_P, 13A_N, 14A_P, 14A_N

### Nets
GND: ESD3.1 J1_15.0 J2_15.0 J3_15.0 J4_15.0 J5_15.0 J30.1ab(GND) J30.1cd(GND) J30.1ef(GND) J30.2ab(GND) J30.2cd(GND) J30.2ef(GND) J30.3ab(GND) J30.3cd(GND) J30.3ef(GND) J30.4ab(GND) J30.4cd(GND) J30.4ef(GND) J30.5ab(GND) J30.5cd(GND) J30.5ef(GND) J30.6ab(GND) J30.6cd(GND) J30.6ef(GND) J30.7ab(GND) J30.7cd(GND) J30.7ef(GND) J30.8ab(GND) J30.8cd(GND) J30.8ef(GND) J30.9ab(GND) J30.9cd(GND) J30.9ef(GND) J30.10ab(GND) J30.10cd(GND) J30.10ef(GND) J31.1ab(GND) J31.1cd(GND) J31.1ef(GND) J31.2ab(GND) J31.2cd(GND) J31.2ef(GND) J31.3ab(GND) J31.3cd(GND) J31.3ef(GND) J31.4ab(GND) J31.4cd(GND) J31.4ef(GND) J31.5ab(GND) J31.5cd(GND) J31.5ef(GND) J31.6ab(GND) J31.6cd(GND) J31.6ef(GND) J31.7ab(GND) J31.7cd(GND) J31.7ef(GND) J31.8ab(GND) J31.8cd(GND) J31.8ef(GND) J31.9ab(GND) J31.9cd(GND) J31.9ef(GND) J31.10ab(GND) J31.10cd(GND) J31.10ef(GND) R17.1 R18.1
VCCP_12V: J30.9a(PWR_+12V) J30.9b(PWR_+12V) J30.10a(PWR_+12V) J30.10b(PWR_+12V)
CLK4A_N: J30.7d(CLK4A_N) ; port CLKs.4A_N  [project net CLKs.4A_N]
CLK4A_P: J30.7c(CLK4A_P) ; port CLKs.4A_P  [project net CLKs.4A_P]
CLK5A_N: J30.6f(CLK5A_N) ; port CLKs.5A_N  [project net CLKs.5A_N]
CLK5A_P: J30.6e(CLK5A_P) ; port CLKs.5A_P  [project net CLKs.5A_P]
CLK6A_N: J30.5d(CLK6A_N) ; port CLKs.6A_N  [project net CLKs.6A_N]
CLK6A_P: J30.5c(CLK6A_P) ; port CLKs.6A_P  [project net CLKs.6A_P]
CLK7A_N: J30.5f(CLK7A_N) ; port CLKs.7A_N  [project net CLKs.7A_N]
CLK7A_P: J30.5e(CLK7A_P) ; port CLKs.7A_P  [project net CLKs.7A_P]
CLK8A_N: J30.4d(CLK8A_N) ; port CLKs.8A_N  [project net CLKs.8A_N]
CLK8A_P: J30.4c(CLK8A_P) ; port CLKs.8A_P  [project net CLKs.8A_P]
CLK9A_N: J30.3d(CLK9A_N) ; port CLKs.9A_N  [project net CLKs.9A_N]
CLK9A_P: J30.3c(CLK9A_P) ; port CLKs.9A_P  [project net CLKs.9A_P]
CLK10A_N: J30.1d(CLK10A_N) ; port CLKs.10A_N  [project net CLKs.10A_N]
CLK10A_P: J30.1c(CLK10A_P) ; port CLKs.10A_P  [project net CLKs.10A_P]
CLK11A_N: J30.2b(CLK11A_N) ; port CLKs.11A_N  [project net CLKs.11A_N]
CLK11A_P: J30.2a(CLK11A_P) ; port CLKs.11A_P  [project net CLKs.11A_P]
CLK12A_N: J30.3f(CLK12A_N) ; port CLKs.12A_N  [project net CLKs.12A_N]
CLK12A_P: J30.3e(CLK12A_P) ; port CLKs.12A_P  [project net CLKs.12A_P]
CLK13A_N: J31.9f(CLK13A_N) ; port CLKs.13A_N  [project net CLKs.13A_N]
CLK13A_P: J31.9e(CLK13A_P) ; port CLKs.13A_P  [project net CLKs.13A_P]
CLK14A_N: J30.7b(CLK14A_N) ; port CLKs.14A_N  [project net CLKs.14A_N]
CLK14A_P: J30.7a(CLK14A_P) ; port CLKs.14A_P  [project net CLKs.14A_P]
HF_CLK4: J3_15.A/1C
HF_CLK5: J3_15.B/1C
HF_CLK6: J3_15.A/1B
HF_CLK7: J3_15.B/1B
HF_CLK8: J3_15.A/1A
HF_CLK9: J3_15.B/1A
HF_CLK10: J2_15.B/1C
HF_CLK11: J2_15.A/1C
HF_CLK12: J2_15.A/1B
LO4: J2_15.B/1B
LO5: J2_15.A/1A
LO6: J2_15.B/1A
LO7: J1_15.B/1C
LO8: J1_15.A/1C
LO9: J1_15.B/1B
LO10: J1_15.A/1B
LO11: J1_15.B/1A
LO12: J1_15.A/1A
REF4: J4_15.A/1C
REF5: J5_15.A/1B
REF6: J5_15.A/1A
REF7: J5_15.B/1A
REF8: J4_15.B/1C
REF9: J4_15.A/1B
REF10: J4_15.B/1A
REF11: J4_15.A/1A
REF12: J4_15.B/1B
RF_CONF4: J31.2d(RF_CONF4)  [project net EN4]
RF_CONF5: J31.2e(RF_CONF5)  [project net EN5]
RF_CONF6: J31.2f(RF_CONF6)  [project net EN6]
RF_CONF7: J31.3a(RF_CONF7)  [project net EN7]
RF_CONF8: J31.3b(RF_CONF8)  [project net EN8]
RF_CONF9: J31.3c(RF_CONF9)  [project net EN9]
RF_CONF10: J31.3d(RF_CONF10)  [project net EN10]
RF_CONF11: J31.3e(RF_CONF11)  [project net EN11]
RF_CONF12: J31.3f(RF_CONF12)  [project net EN12]
RF_ZE: Ref1B.1(Ref_ZE) Ref1T.1(Ref_ZE) Ref2B.1(Ref_ZE) Ref2T.1(Ref_ZE) Ref3B.1(Ref_ZE) Ref3T.1(Ref_ZE)
NetESD1_1: ESD1.1 R17.2
NetESD2_1: ESD2.1 R18.2

Not connected (* = marked no-connect by the designer): J5_15 A/1C B/1B B/1C; J30 1a(CLK14B_P) 1b(CLK14B_N) 1e(CLK10B_P) 1f(CLK10B_N) 2c(CLK11B_P) 2d(CLK11B_N) 2e(CLK12B_P) 2f(CLK12B_N) 3a(CLK9B_P) 3b(CLK9B_N) 4a(CLK8B_P) 4b(CLK8B_N) 4e(CLK7B_P) 4f(CLK7B_N) 5a(CLK6B_P) 5b(CLK6B_N) 6a(RESET+) 6b(RESET-) 6c(CLK5B_P) 6d(CLK5B_N) 7e(CLK4B_P) 7f(CLK4B_N) 8a(PWR_ON) 8b(ENABLE#) 8c(GA2) 8d(GA1) 8e(GA0) 8f 9c(MP+3.3V) 9d(SCL_L) 9e(SCL_E) 9f(SCL_I) 10c(PS1#) 10d(SDA_L) 10e(SDA_E) 10f(SDA_I); J31 1a(DATAa_P) 1b(DATAa_N) 1c(DATAb_P) 1d(DATAb_N) 1e(CLKc_P) 1f(CLKc_N) 2a(RF_CONF1) 2b(RF_CONF2) 2c(RF_CONF3) 4a 4b 4c 4d 4e 4f 5a 5b 5c 5d 5e 5f 6a 6b 6c 6d 6e 6f 7a 7b 7c 7d 7e 7f 8a 8b 8c 8d 8e 8f 9a 9b 9c 9d 10a 10b 10c 10d 10e(CLK13B_P) 10f(CLK13B_N)

### Buses and harness runs
bus HF_CLK[4..12] = port HF_CLK[4..12]
bus LO[4..12] = port LO[4..12]
bus REF[4..12] = port REF[4..12]
bus RF_CONF[4..12] = port RF_CONF[4..12]

### Layout directives
differential pair: CLKs.4A_N, CLKs.4A_P, CLKs.5A_N, CLKs.5A_P, CLKs.6A_N, CLKs.6A_P, CLKs.7A_N, CLKs.7A_P, CLKs.8A_N, CLKs.8A_P, CLKs.9A_N, CLKs.9A_P, CLKs.10A_N, CLKs.10A_P, CLKs.11A_N, CLKs.11A_P, CLKs.12A_N, CLKs.12A_P, CLKs.13A_N, CLKs.13A_P, CLKs.14A_N, CLKs.14A_P
net class 50_Ohms: (no net found under the mark)

### Notes on the sheet
- Project/Equipment
- Document
- Designer
- Drawn by
- Check.by
- File
- Last Mod.
- Print Date
- Sheet
- Size
- A3
- of
- Rev

### Library data of the parts
ESD1-ESD3 = ESD: ESD Strip
J30 = ERmetZD 3-10 Connector 1: Zone3 Backplane Connector - eRTM15 J30; ManufacturerNr: 973028; Manufacturer: ERNI; Distributor: ERNI; DistributorNr: 973028; Type: THT; Value: *; Package: *
J31 = ERmetZD 3-10 Connector 2: Zone3 Backplane Connector - eRTM15 J31; Manufacturer: ERNI; ManufacturerNr: 973028; Distributor: ERNI; DistributorNr: 973028; Type: THT
R17 R18 = Res3: Resistor; ManufacturerNr: MCHP06W2F1005T5E; Manufacturer: MULTICOMP; Power: 0.5W; Temp. Coeff.: 100ppm; Voltage: 50V; Value: 10M; Type: SMT; Package: 1206
Ref1B Ref1T Ref2B Ref2T Ref3B Ref3T = Ref_Pad: Reference Pad for SMD assembling; Package: RefPad_1.5mm
  Ref1B: Value: Ref1B
  Ref1T: Value: Ref1T
  Ref2B: Value: Ref2B
  Ref2T: Value: Ref2T
  Ref3B: Value: Ref3B
  Ref3T: Value: Ref3T
J1_15 J2_15 J3_15 J4_15 J5_15 = CoaxiPack (Radiall): Manufacturer: Radiall; ManufacturerNr: R694.252.107W

## Sheet CLK_Mezzanine.SchDoc: =ProjectName
size 420 x 297 mm; Author: SBH; CompanyName: WUT; DrawnBy: SBH; Organization: ISE-WUT; Address1: Warsaw Univeristy of Technology; Address2: Nowowiejska 15/19; DocumentNumber: 10; Revision: -; SheetNumber: 10; SheetTotal: 12; EDA_Number: ARTIQ; Projet: eRTM15 Baikal; ModifiedBy: -; CreateDate: XX/XX/XXXX; CheckedDate: -; Title2: CLK_Mezzanine.SchDoc; DivGrp: ISE; Designer: SBH; ModifiedDate: -; ProjectName: eRTM15 Baikal
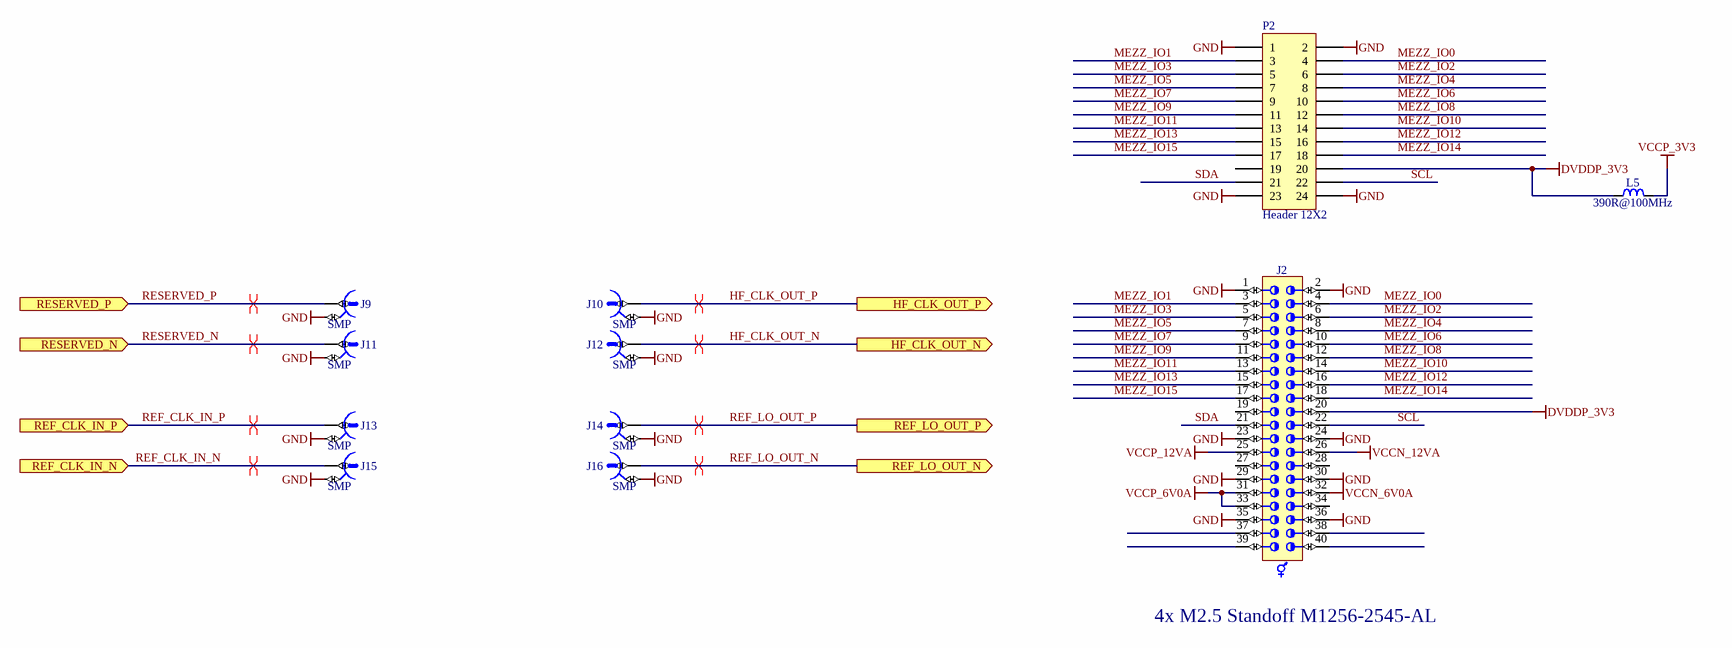
[diagram p4: CLK_Mezzanine.SchDoc]

### Parts
J2  (no value)  [SAMTEC_LSS-120-03-L-DV-A]
J9  SMP  [MOLEX_85305-0232]
J10  SMP  [MOLEX_85305-0232]
J11  SMP  [MOLEX_85305-0232]
J12  SMP  [MOLEX_85305-0232]
J13  SMP  [MOLEX_85305-0232]
J14  SMP  [MOLEX_85305-0232]
J15  SMP  [MOLEX_85305-0232]
J16  SMP  [MOLEX_85305-0232]
L5  390R@100MHz  [INDC1608X95N]
P2  Header 12X2  [HDR2X12]

### Ports
HF_CLK_OUT_N (out), HF_CLK_OUT_P (out), REF_CLK_IN_N (in), REF_CLK_IN_P (in), REF_LO_OUT_N (out), REF_LO_OUT_P (out), RESERVED_N (in), RESERVED_P (in)

### Nets
DVDDP_3V3: J2.20 L5.1 P2.20
GND: J2.1 J2.2 J2.23 J2.24 J2.29 J2.30 J2.35 J2.36 J9.2 J10.2 J11.2 J12.2 J13.2 J14.2 J15.2 J16.2 P2.1 P2.2 P2.23 P2.24
VCCN_6V0A: J2.32
VCCN_12VA: J2.26
VCCP_3V3: L5.2
VCCP_6V0A: J2.31 J2.33
VCCP_12VA: J2.25
HF_CLK_OUT_N: J12.1 ; port HF_CLK_OUT_N
HF_CLK_OUT_P: J10.1 ; port HF_CLK_OUT_P
MEZZ_IO0: J2.4 P2.4
MEZZ_IO1: J2.3 P2.3
MEZZ_IO2: J2.6 P2.6
MEZZ_IO3: J2.5 P2.5
MEZZ_IO4: J2.8 P2.8
MEZZ_IO5: J2.7 P2.7
MEZZ_IO6: J2.10 P2.10
MEZZ_IO7: J2.9 P2.9
MEZZ_IO8: J2.12 P2.12
MEZZ_IO9: J2.11 P2.11
MEZZ_IO10: J2.14 P2.14
MEZZ_IO11: J2.13 P2.13
MEZZ_IO12: J2.16 P2.16
MEZZ_IO13: J2.15 P2.15
MEZZ_IO14: J2.18 P2.18
MEZZ_IO15: J2.17 P2.17
REF_CLK_IN_N: J15.1 ; port REF_CLK_IN_N
REF_CLK_IN_P: J13.1 ; port REF_CLK_IN_P
REF_LO_OUT_N: J16.1 ; port REF_LO_OUT_N
REF_LO_OUT_P: J14.1 ; port REF_LO_OUT_P
RESERVED_N: J11.1 ; port RESERVED_N
RESERVED_P: J9.1 ; port RESERVED_P
SCL: J2.22 P2.22
SDA: J2.21 P2.21

Not connected (* = marked no-connect by the designer): J2 19 27 28 34 37 38 39 40; P2 19

### Layout directives
differential pair: HF_CLK_OUT_N, HF_CLK_OUT_P, REF_CLK_IN_N, REF_CLK_IN_P, REF_LO_OUT_N, REF_LO_OUT_P, RESERVED_N, RESERVED_P

### Notes on the sheet
- 4x M2.5 Standoff M1256-2545-AL
- Project/Equipment
- Document
- Designer
- Drawn by
- Check.by
- File
- Last Mod.
- Print Date
- Sheet
- Size
- A3
- of
- Rev

### Library data of the parts
J2 = SAMTEC_LSS-120-03-L-DV-A: Connector 40 Hermaphroditic; Part Description: 40 Contacts, Pitch 0.635mm, Razor Beam LSS Vertical High Speed Hermaphroditic Strip (Lead Style 5.49mm); Manufacturer: SAMTEC; PressFit: No; Part Number: SAMTEC_LSS-120-03-L-DV-A; Component Kind: Standard; Component Type: Standard; Pin Count: 40; Mounted: Yes; Socket: No; Sense: No; SMD: Yes; Status: None; Manufacturer Part Number: LSS-120-03-L-DV-A; ComponentHeight: 5.57mm; HelpURL: \\cern.ch\dfs\Applications\Altium\Datasheets\SAMTEC_LSS-120-03-L-DV-A.pdf; Author: CERN DEM JMW; CreateDate: 10.11.2015; LatestRevisionDate: 10.11.2015
J9-J16 = MOLEX_85305-0232: Part Description: 50 Ohms, SMP Surface Mount Plug, Limited Detent; Manufacturer: MOLEX; PressFit: No; Part Number: MOLEX_85305-0232; Component Kind: Standard; Component Type: Standard; Pin Count: 2; Family: SMP; Mounted: Yes; Socket: No; SMD: Yes; Sense: No; Status: None; Manufacturer Part Number: 85305-0232; ComponentHeight: 4.1mm; HelpURL: \\cern.ch\dfs\Applications\Altium\Datasheets\MOLEX_85305-0232.pdf; Author: CERN DEM JMW; CreateDate: 09.08.2016; LatestRevisionDate: 09.08.2016
L5 = IND0603_TDK_MPZ1608R391A: as L6 on sheet PowerSupply; Part Number: IND0603_TDK_MPZ1608R391A; Component Kind: Standard; Component Type: Standard; Pin Count: 2; Value: 390R@100MHz; Status: None; Manufacturer Part Number: MPZ1608R391A; Case: 0603; Mounted: Yes; Socket: No; SMD: Yes; Sense: No; ComponentHeight: 0.95mm; HelpURL: \\cern.ch\dfs\Applications\Altium\Datasheets\IND0603_TDK_MPZ1608.pdf; Author: CERN DEM JLC; CreateDate: 2009-12-02; LatestRevisionDate: 2009-12-02
P2 = Header 12X2: Header, 12-Pin, Dual row; LatestRevisionDate: 17-Jul-2002; LatestRevisionNote: Re-released for DXP Platform.; Publisher: Altium Limited